# EAGLE schematic LC_Board (EAGLE 9.6.2)
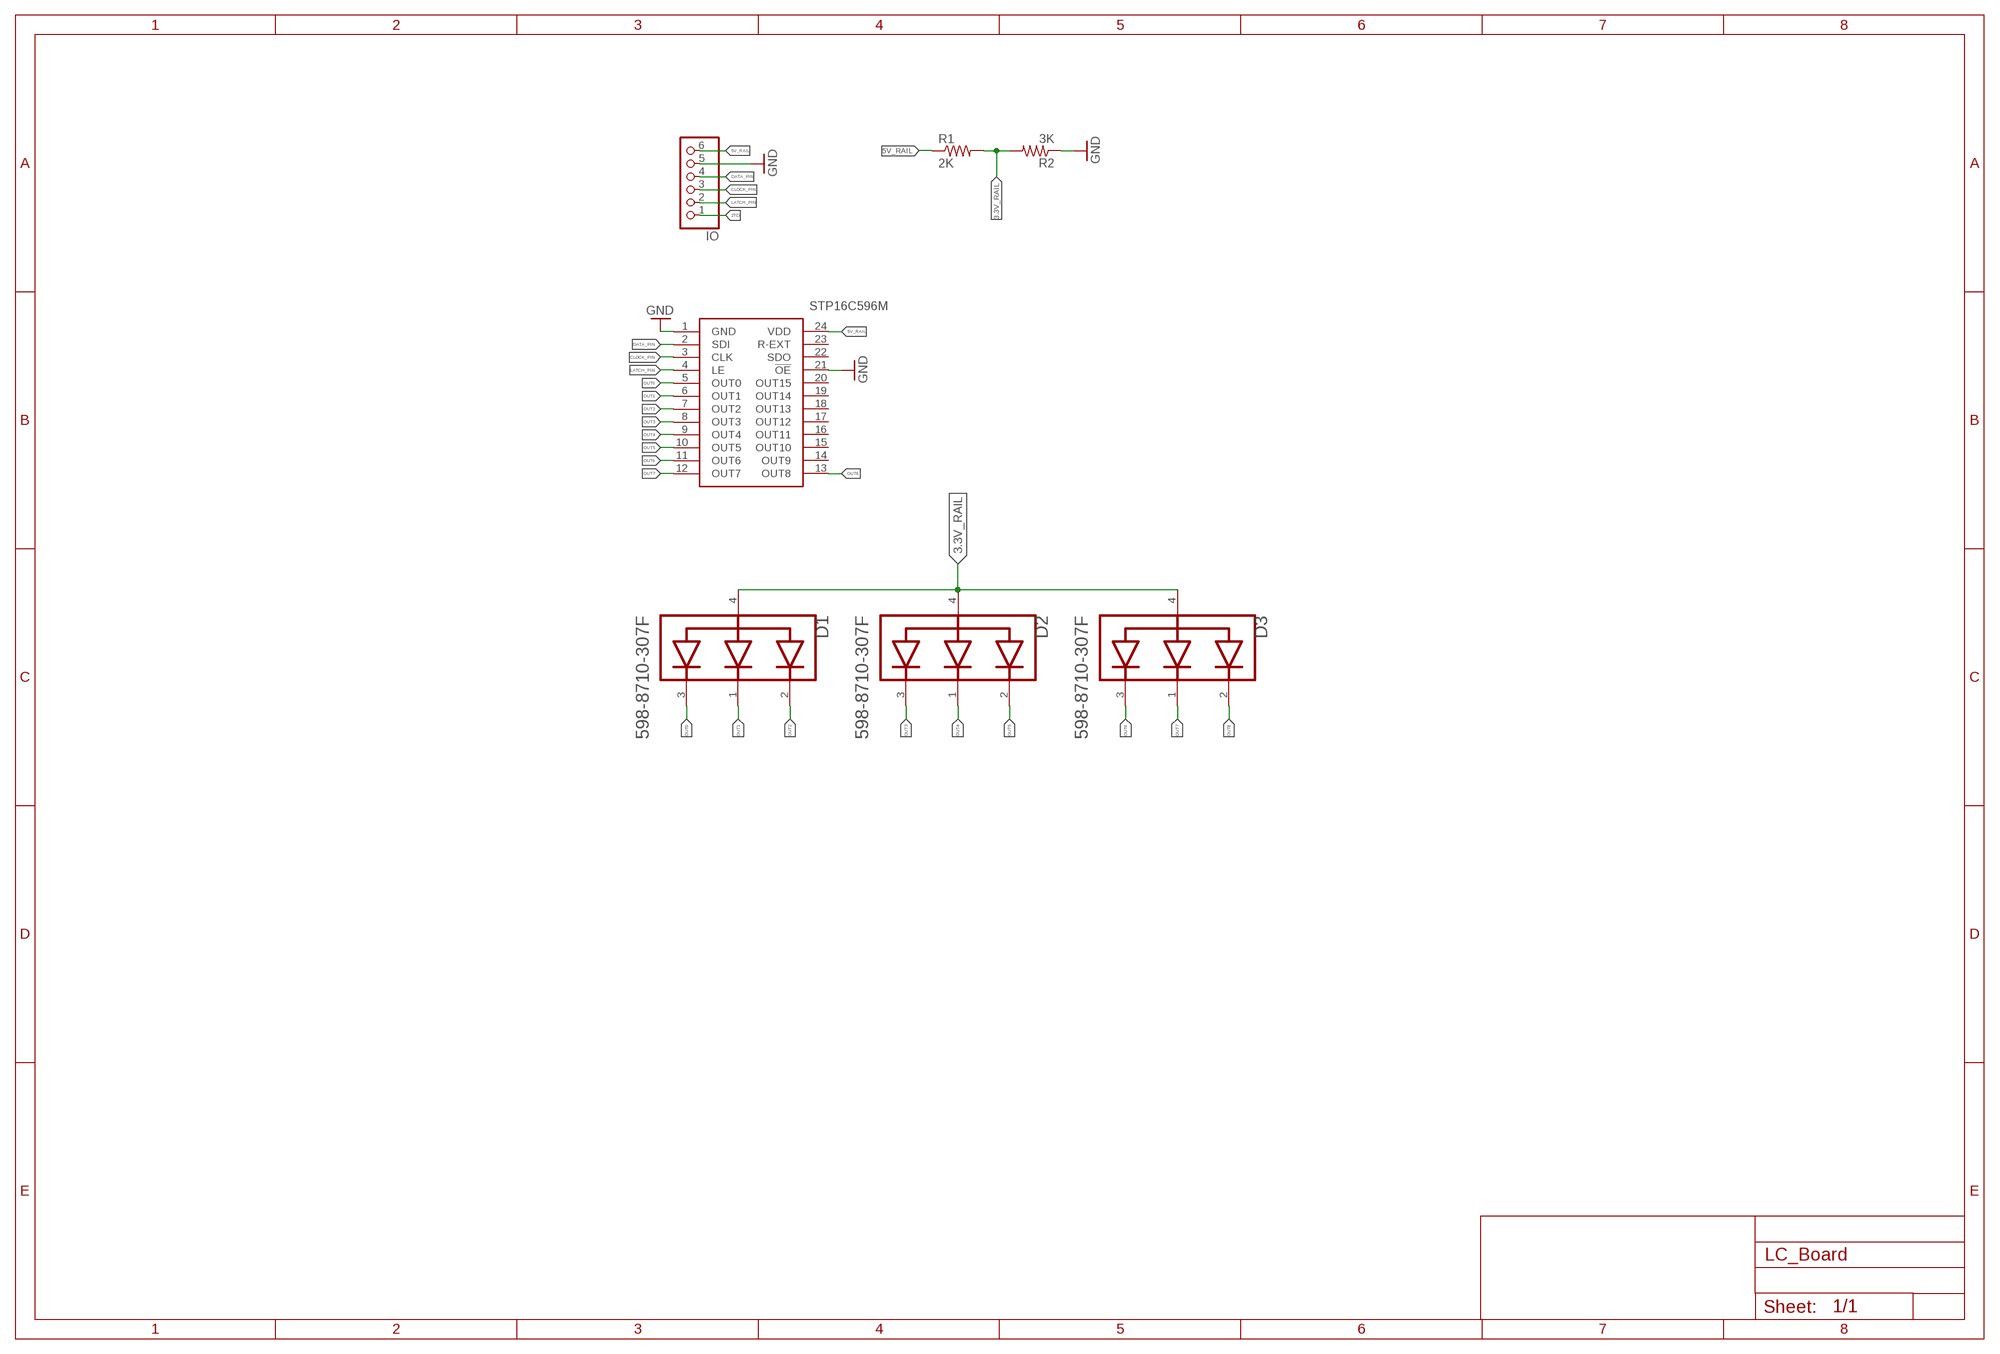
[diagram p0: schematic, sheet 1]

## Parts
D1  DIALIGHT_598-8710-307FDIALIGHT_598-8710-307F_0_0  [DIALIGHT_598-8710-307F_0]
D2  DIALIGHT_598-8710-307FDIALIGHT_598-8710-307F_0_0  [DIALIGHT_598-8710-307F_0]
D3  DIALIGHT_598-8710-307FDIALIGHT_598-8710-307F_0_0  [DIALIGHT_598-8710-307F_0]
IC1  STP16C596M  [SOP65P638X110-24N]
IO  PINHD-1X6CLEAN  [1X06-CLEAN]
R1  2K  FLIPFLOP-RES  [0805-THM]
R2  3K  FLIPFLOP-RES  [0805-THM]

## Nets
2TD: IO.1
3.3V_RAIL: D1.4(COMMON_ANODE) D2.4(COMMON_ANODE) D3.4(COMMON_ANODE) R1.2 R2.2
5V_RAIL: IC1.24(VDD) IO.6 R1.1
CLOCK_PIN: IC1.3(CLK) IO.3
DATA_PIN: IC1.2(SDI) IO.4
GND: IC1.1(GND) IC1.21(!OE) IO.5 R2.1
LATCH_PIN: IC1.4(LE) IO.2
OUT0: D1.3(BLUE_CATHODE) IC1.5(OUT0)
OUT1: D1.1(GREEN_CATHODE) IC1.6(OUT1)
OUT2: D1.2(RED_CATHODE) IC1.7(OUT2)
OUT3: D2.3(BLUE_CATHODE) IC1.8(OUT3)
OUT4: D2.1(GREEN_CATHODE) IC1.9(OUT4)
OUT5: D2.2(RED_CATHODE) IC1.10(OUT5)
OUT6: D3.3(BLUE_CATHODE) IC1.11(OUT6)
OUT7: D3.1(GREEN_CATHODE) IC1.12(OUT7)
OUT8: D3.2(RED_CATHODE) IC1.13(OUT8)
Unconnected: IC1.14(OUT9) IC1.15(OUT10) IC1.16(OUT11) IC1.17(OUT12) IC1.18(OUT13) IC1.19(OUT14) IC1.20(OUT15) IC1.22(SDO) IC1.23(R-EXT)

## Library data of the parts
D1-D3 = Dialight - 598-8710-307F:DIALIGHT_598-8710-307F: Micro LED; CENTROID_NOT_SPECIFIED: No; DATASHEET: https://media.digikey.com/pdf/Data%20Sheets/Dialight%20PDFs/598_Series_0606_Pkg.pdf; DIGIKEY_DESCRIPTION: DIODE LED RGB CLEAR 0606 SMD; DIGIKEY_PART_NUMBER: 350-2096-1-ND; LEAD_FREE: yes; MF: Dialight; MOUSER_PART_NUMBER: 645-598-8710-307F; MPN: 598-8710-307F; PACKAGE: LED_SMD; PREFIX: D; ROHS: yes; SPICEPREFIX: E; TEMPERATURE_RANGE_HIGH: +100°C; TEMPERATURE_RANGE_LOW: -40°C
IC1 = STP16C596M:STP16C596M: LED Display Drivers 16-Bit Curr LED Sink Source: Datasheet <https://ms.componentsearchengine.com/Datasheets/1/STP16C596M.pdf>; DESCRIPTION: LED Display Drivers 16-Bit Curr LED Sink; HEIGHT: 1.1mm; MANUFACTURER_NAME: STMicroelectronics; MANUFACTURER_PART_NUMBER: STP16C596M
IO = adafruit:PINHD-1X6: PIN HEADER
R1 R2 = adafruit:FLIPFLOP-RES: Flip Flop resistor An 0805 resistor inside a standard 1/4W 5% resistor. Makes for easy mods